# EAGLE design A702X (EAGLE 6.6.0)
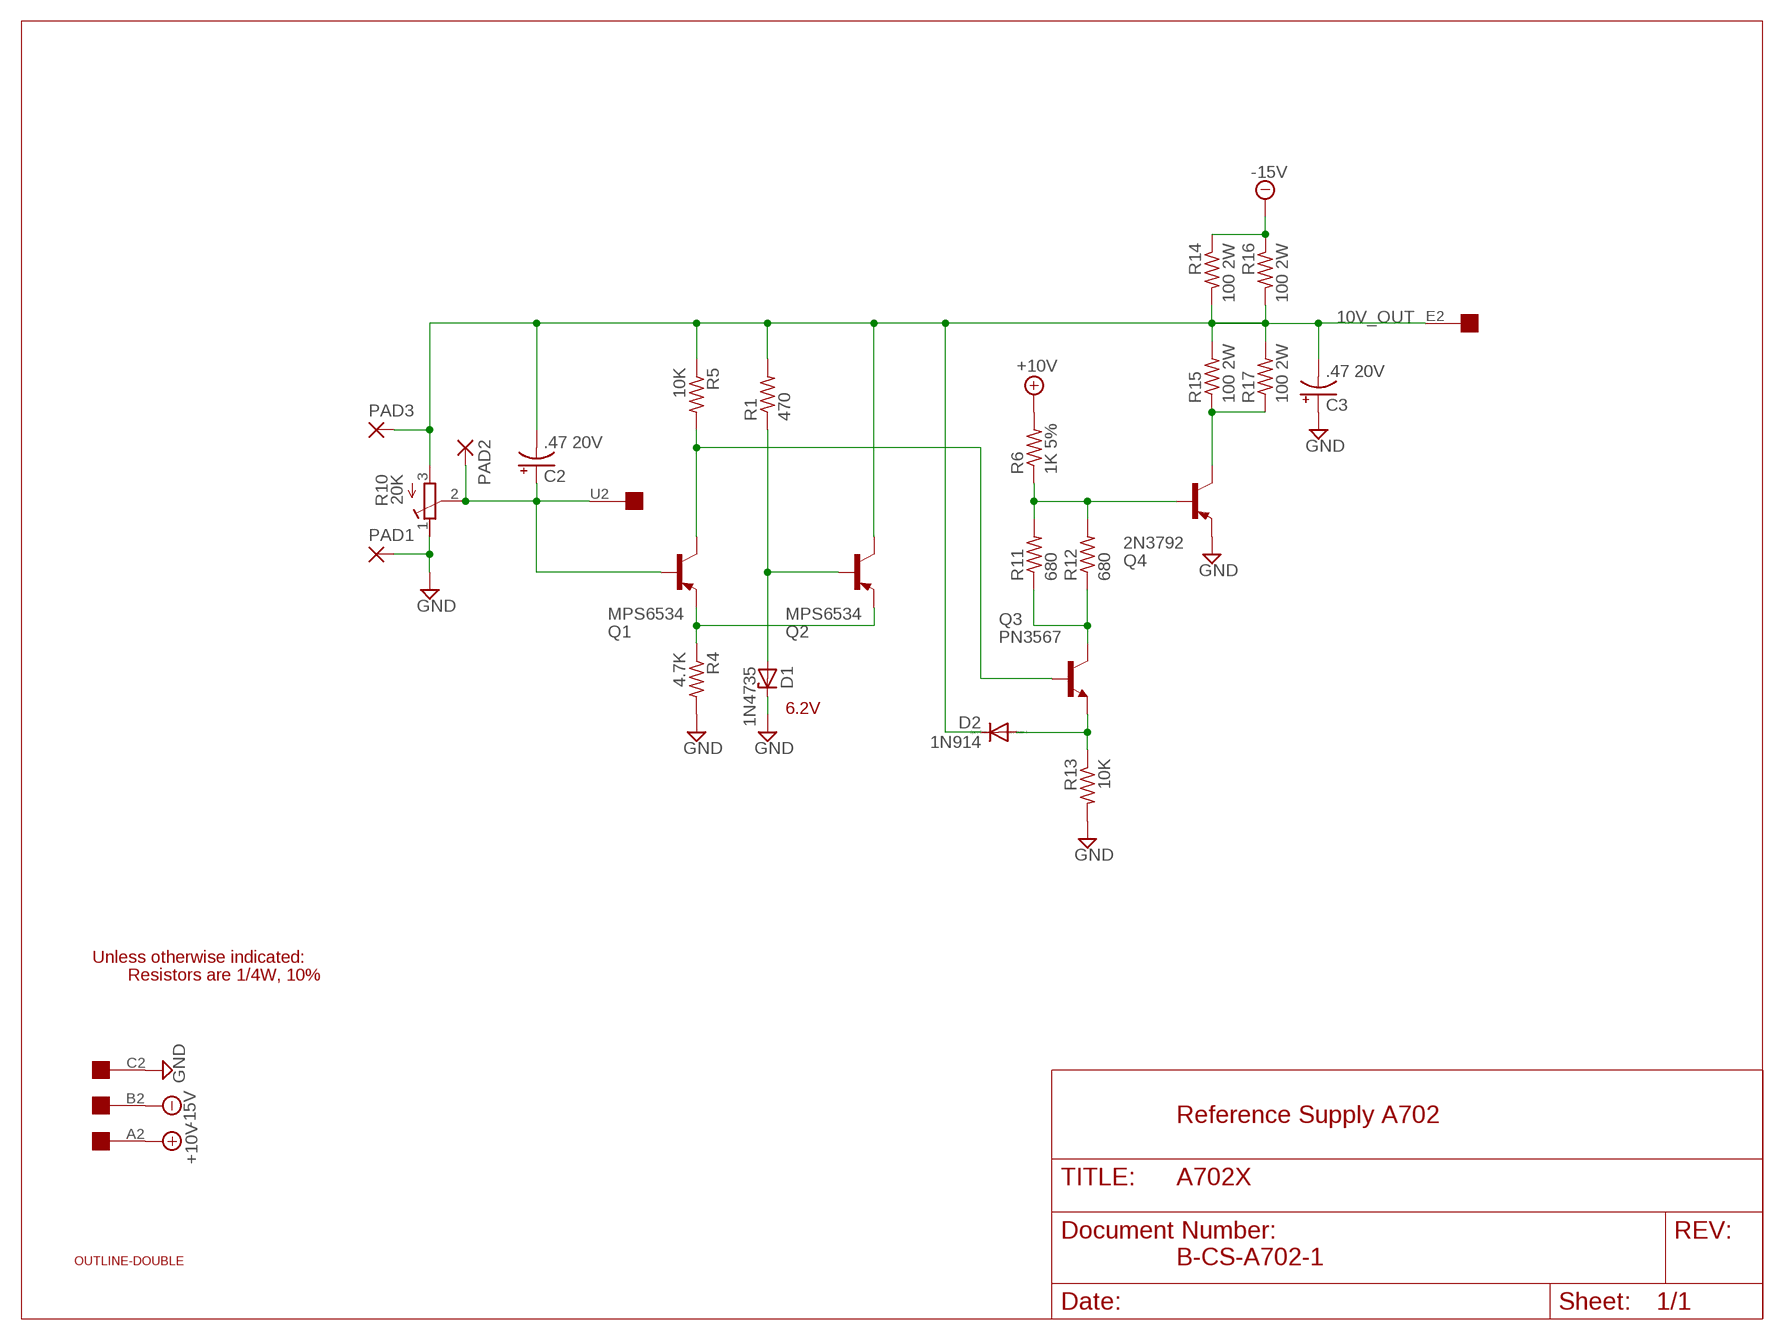
[diagram p0: schematic, sheet 1]

## Parts
C2  .47 20V  CPOL-USE22-6AXIAL  [E22-6]
C3  .47 20V  CPOL-USE22-6AXIAL  [E22-6]
D1  1N4735  1N821  [DO35Z10]
D2  1N914  1N4148DO35-10  [DO35-10]
PAD1  2,54/0,8  [2,54/0,8]
PAD2  2,54/0,8  [2,54/0,8]
PAD3  2,54/0,8  [2,54/0,8]
Q1  MPS6534  2N2904A  [TO39]
Q2  MPS6534  2N2904A  [TO39]
Q3  PN3567  2N2219  [TO5]
Q4  2N3792  -PNP-TO3  [TO3]
R1  470  R-US_0207/10  [0207/10]
R4  4.7K  R-US_0207/10  [0207/10]
R5  10K  R-US_0207/10  [0207/10]
R6  1K 5%  R-US_0207/10  [0207/10]
R10  20K  275P  [3006Y]
R11  680  R-US_0207/10  [0207/10]
R12  680  R-US_0207/10  [0207/10]
R13  10K  R-US_0207/10  [0207/10]
R14  100 2W  R-US_0817/22  [P0817/22]
R15  100 2W  R-US_0817/22  [P0817/22]
R16  100 2W  R-US_0817/22  [P0817/22]
R17  100 2W  R-US_0817/22  [P0817/22]
U$1  OUTLINE-DOUBLE  [DOUBLE]
U$3  EDGE-1  [EDGE-CON1]

## Nets
10V_OUT: C2.- C3.- D2.C PAD3.1(P) Q2.3(C) R1.2 R5.1 R10.3(E) R14.2 R15.2 R16.2 R17.2 U$3.E2
+10V: R6.2 U$3.A2
-15V: R14.1 R16.1 U$3.B2
GND [supply]: C3.+ D1.C PAD1.1(P) Q4.E R4.2 R10.1(A) R13.2 U$3.C2
N$1: Q1.1(E) Q2.1(E) R4.1
N$2: Q3.3(C) R11.1 R12.1
N$3: Q1.3(C) Q3.2(B) R5.2
N$4: Q4.C R15.1 R17.1
N$5: D2.A Q3.1(E) R13.1
N$6: D1.A Q2.2(B) R1.1
N$7: Q4.B R6.1 R11.2 R12.2
U2: C2.+ PAD2.1(P) Q1.2(B) R10.2(S) U$3.U2
Unconnected: U$3.D2 U$3.F2 U$3.H2 U$3.J2 U$3.K2 U$3.L2 U$3.M2 U$3.N2 U$3.P2 U$3.R2 U$3.S2 U$3.T2 U$3.V2

## Notes on the sheet
- 6.2V
- Unless otherwise indicated:
- Resistors are 1/4W, 10%
- Reference Supply A702
- B-CS-A702-1

## Library data of the parts
C2 C3 = rcl:CPOL-US: POLARIZED CAPACITOR, American symbol
D1 = diode:1N821: Reference DIODE temperature compensated, 6,2 V
D2 = diode:1N4148: DIODE high speed (Philips)
PAD1-PAD3 = wirepad:2,54/0,8: THROUGH-HOLE PAD
Q1 Q2 = transistor-pnp:2N2904*: PNP Transistror
Q3 = transistor:2N2219: NPN TRANSISTOR
Q4 = transistor:*-PNP-: PNP Transistror
R1 R4-R6 R11-R17 = rcl:R-US_: RESISTOR, American symbol
R10 = dec-con:275P: Trimpot with 275P (3006Y) footprint.
U$1 = dec-con:OUTLINE-*: Board outlines for DEC boards.
U$3 = dec-con:EDGE-1: Single-Sided DEC Edge Connector -- (side 2)

## Board
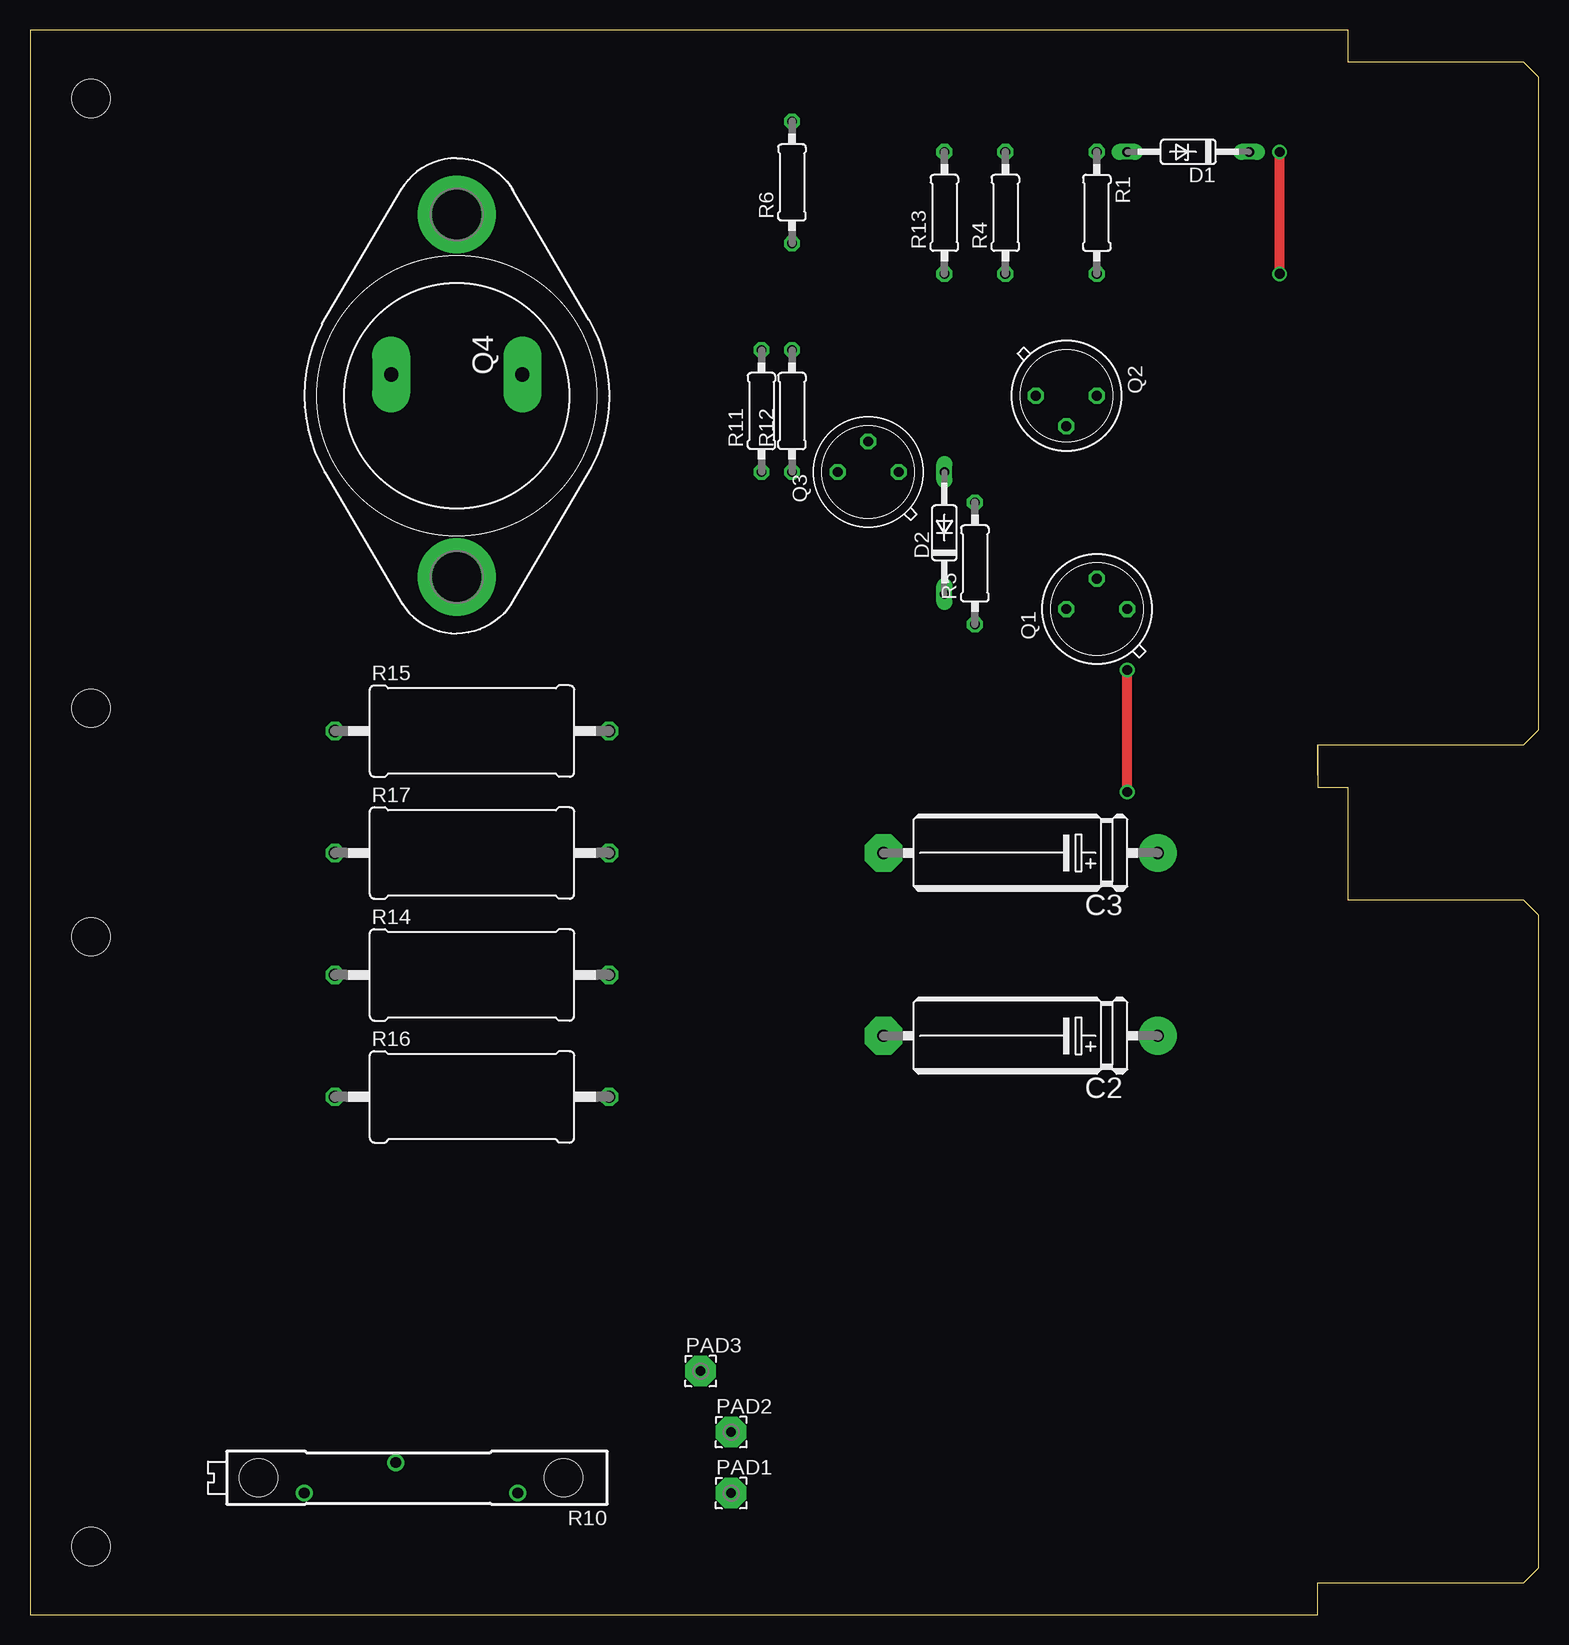
[diagram p1: board, top side]
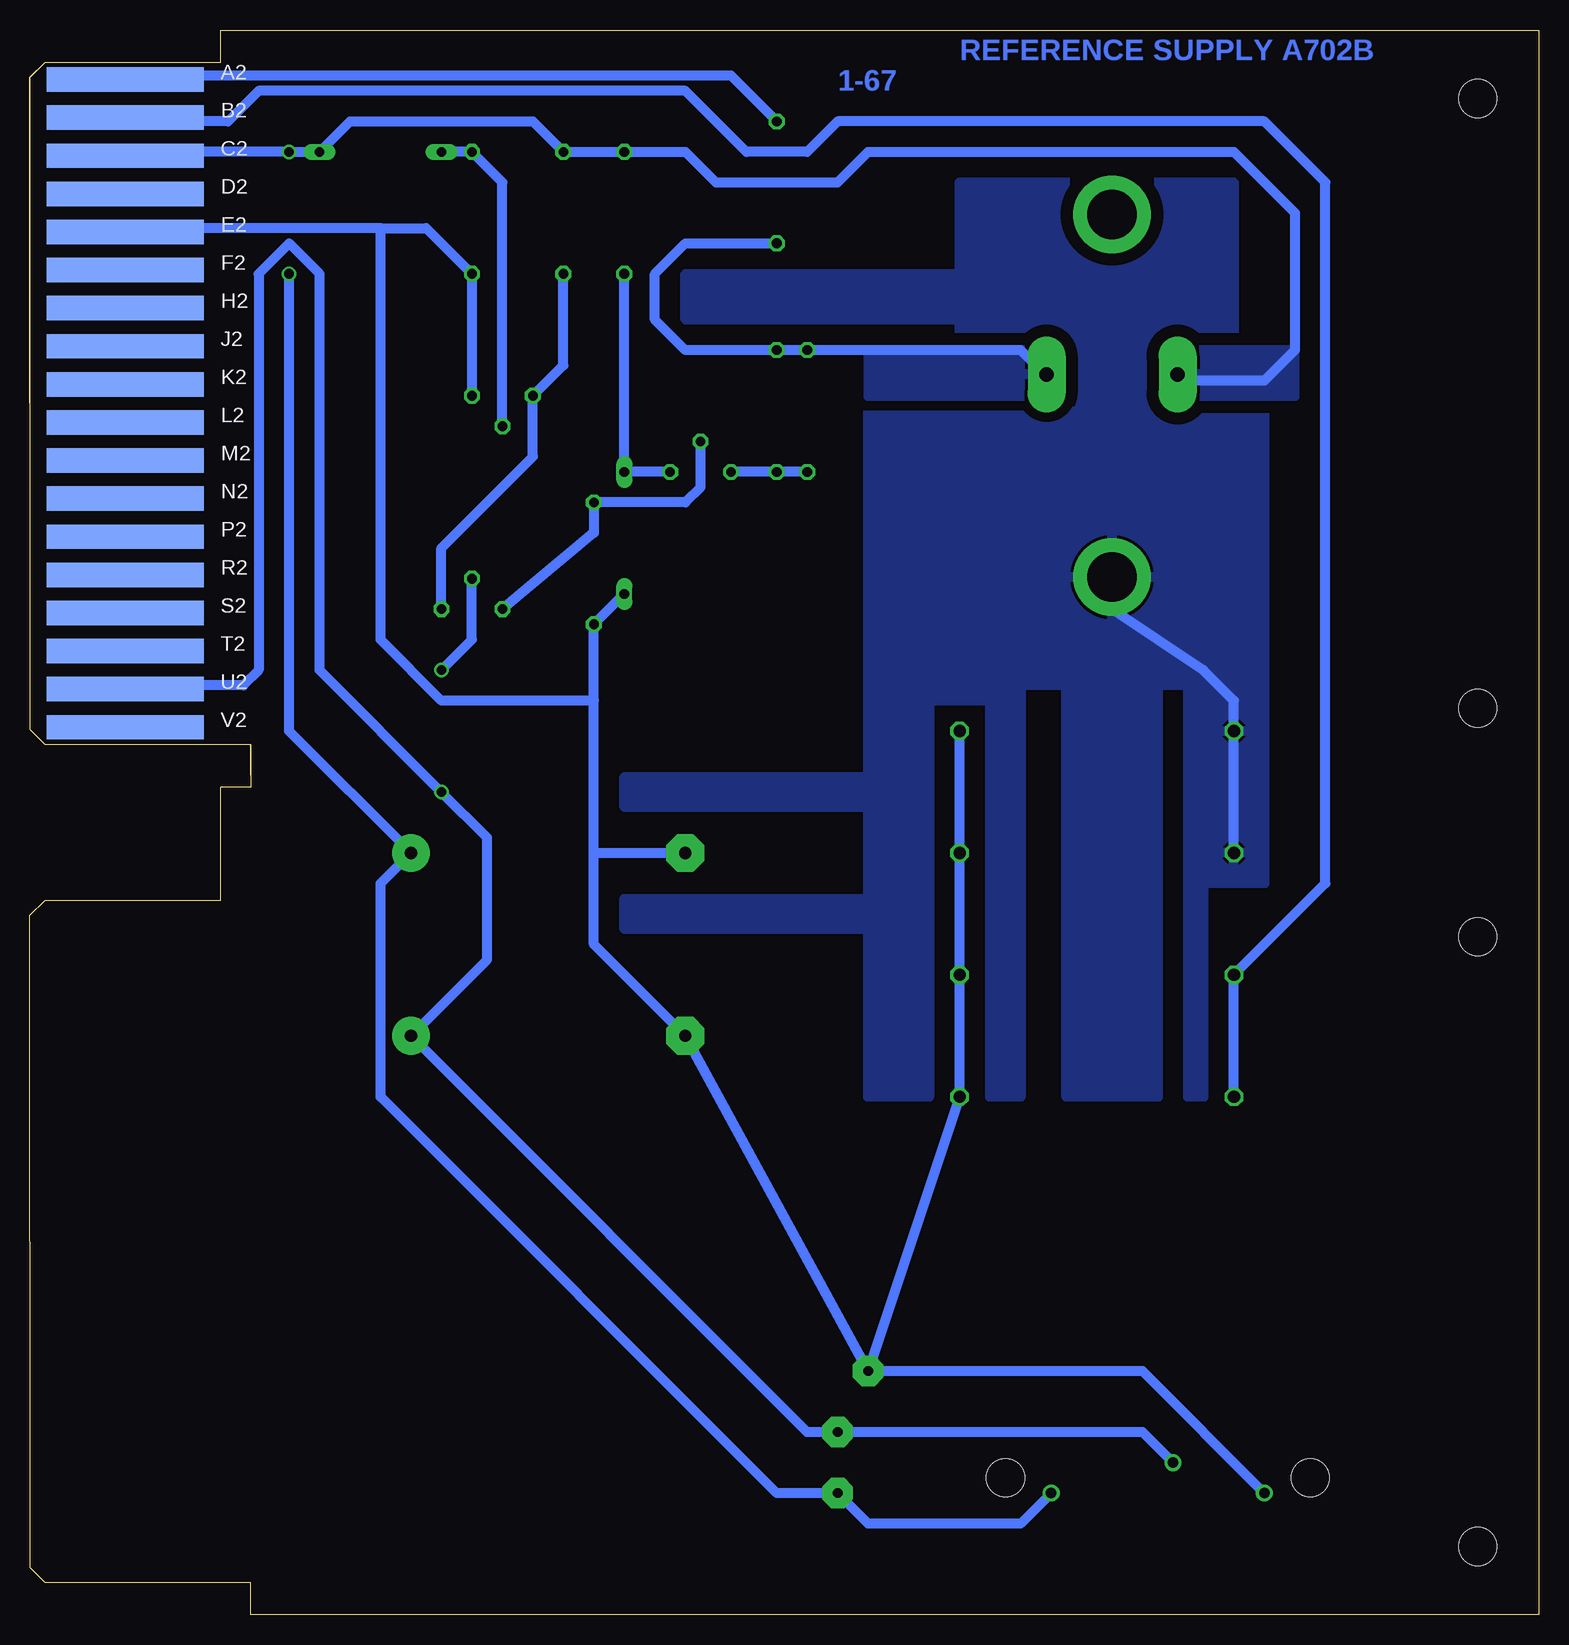
[diagram p2: board, bottom side, seen from below]

Size 125.73 x 132.08 mm. Coordinates in mm from the lower left corner, seen from the top.
Copper layers (1+16): Top 0.035mm / dielectric 1.5mm / Bottom 0.035mm
Design rules "16mils": minimum track width 16mil, minimum drill 32mil, track to track 15mil, track to pad 10mil, pad to pad 10mil, via to via 10mil, smd to smd 10mil, copper to edge 13mil, drill to drill 10mil, minimum pad ring 10mil, minimum via ring 8mil, stop-mask expansion 0mil, vias tented up to drill 0mil, thermal gap 10mil
Holes 3.17 mm at 19.05,11.43 44.45,11.43

### Footprints (pad centres in the part's own frame; a part is rotated, then mirrored left to right if it is on the bottom)
E22-6 = drill 1.016 pad 3.15: + -11.43,0 | drill 1.016 pad 3.15 octagon: - 11.43,0
DO35Z10 = drill 0.813 long: A 5.08,0; C -5.08,0
DO35-10 = drill 0.813 long: A 5.08,0; C -5.08,0
2,54/0,8 = drill 0.813 pad 2.54 octagon: 1 0,0
TO39 = drill 0.813 octagon: 1 0,-2.54; 2 2.54,0; 3 0,2.54
TO5 = drill 0.813 octagon: 1 0,-2.54; 2 2.54,0; 3 0,2.54
TO3 = drill 1.194 pad 3.15 long: B -1.778,5.461; E -1.778,-5.461 | drill 4.115 pad 6.477: C 15.113,0; C/ -15.113,0
0207/10 = drill 0.813 octagon: 1 -5.08,0; 2 5.08,0
3006Y = drill 0.9: 1 -8.89,1.27; 2 1.27,-1.27; 3 8.89,1.27
P0817/22 = drill 1.016 octagon: 1 -11.43,0; 2 11.43,0
DOUBLE = hole 3.175: 120.65,56.515; 120.65,5.715; 120.65,75.565; 120.65,126.365
EDGE-CON1 = smd 13.106 x 2.032 bottom: A2 7.938,4.128; B2 7.938,7.303; C2 7.938,10.477; D2 7.938,13.652; E2 7.938,16.828; F2 7.938,20.003; H2 7.938,23.177; J2 7.938,26.352; K2 7.938,29.527; L2 7.938,32.703; M2 7.938,35.877; N2 7.938,39.053; P2 7.938,42.227; R2 7.938,45.403; S2 7.938,48.578; T2 7.938,51.752; U2 7.938,54.928; V2 7.938,58.102

### Placement (x,y rotation side)
C2  82.55,48.26 180 top
C3  82.55,63.5 180 top
D1  96.52,121.92 180 top
D2  76.2,90.17 90 top
PAD1  58.42,10.16 0 top
PAD2  58.42,15.24 0 top
PAD3  55.88,20.32 0 top
Q1  88.9,83.82 90 top
Q2  86.36,101.6 270 top
Q3  69.85,95.25 90 top
Q4  35.56,101.6 270 top
R1  88.9,116.84 270 top
R4  81.28,116.84 90 top
R5  78.74,87.63 90 top
R6  63.5,119.38 90 top
R10  31.75,11.43 180 top
R11  60.96,100.33 90 top
R12  63.5,100.33 90 top
R13  76.2,116.84 90 top
R14  36.83,53.34 0 top
R15  36.83,73.66 0 top
R16  36.83,43.18 0 top
R17  36.83,63.5 0 top
U$1  125.73,132.08 180 top
U$3  125.73,132.08 180 top

### Tracks (layer width: path | path; a pad name or v marks a point on that pad's centre or on a via)
10V_OUT
  Bottom 0.813: U$3.E2 117.17,115.24 116.84,115.57 96.52,115.57 | 96.52,115.57 92.71,115.57 R1.2 Q2.3 | D2.C R5.1 78.74,76.2 | 78.74,63.5 C3.- | 78.74,63.5 78.74,76.2 | 78.74,63.5 78.74,55.88 C2.- PAD3.1 | R15.2 R17.2 R14.2 R16.2 PAD3.1 | R10.3 33.02,20.32 PAD3.1 | 78.74,76.2 91.44,76.2 96.52,81.28 96.52,115.57
+10V
  Bottom 0.813: U$3.A2 116.84,127.89 116.84,128.27 67.31,128.27 R6.2
-15V
  Bottom 0.813: U$3.B2 117.13,124.75 116.84,124.46 109.22,124.46 106.68,127 71.12,127 66.04,121.92 60.96,121.92 58.42,124.46 22.86,124.46 17.78,119.38 17.78,60.96 R14.1 R16.1
GND  (via drill 0.81)
  Top 0.813: v104.14,111.76 v104.14,121.92
  Bottom 0.813: U$3.C2 117.17,121.59 116.84,121.92 v104.14,121.92 D1.C 99.06,124.46 83.82,124.46 R4.2 R13.2 71.12,121.92 68.58,119.38 58.42,119.38 55.88,121.92 25.4,121.92 20.32,116.84 20.32,105.41 22.86,102.87 29.21,102.87 Q4.E | R10.1 43.18,7.62 55.88,7.62 PAD1.1 63.5,10.16 96.52,43.18 96.52,60.96 C3.+ 104.14,73.66 v104.14,111.76
  pour Bottom (isolate 1.016): 30.48,101.6 20.32,101.6 20.32,105.41 30.48,105.41
N$1
  Bottom 0.813: R4.1 81.28,104.14 Q2.1 83.82,96.52 91.44,88.9 Q1.1
N$2
  Bottom 0.813: R11.1 R12.1 Q3.3
N$3
  Bottom 0.813: Q3.2 69.85,93.98 71.12,92.71 R5.2 78.74,90.17 Q1.3
N$4
  Bottom 0.813: R17.1 R15.1 25.4,76.2 27.94,78.74 35.56,83.82 Q4.C
  pour Bottom (isolate 0.813, rank 2): 31.75,93.98 31.75,43.18 39.37,43.18 39.37,93.98
  pour Bottom (isolate 1.016, rank 2): 22.86,60.96 27.94,60.96 27.94,43.18 29.21,43.18 29.21,77.47 48.26,77.47 48.26,107.95 71.12,107.95 71.12,111.76 48.26,111.76 48.26,119.38 25.4,119.38 25.4,100.33 22.86,100.33
  pour Bottom (isolate 0.813, rank 2): 43.18,43.18 45.72,43.18 45.72,76.2 50.8,76.2 50.8,43.18 55.88,43.18 55.88,57.15 76.2,57.15 76.2,59.69 55.88,59.69 55.88,67.31 76.2,67.31 76.2,69.85 55.88,69.85 55.88,100.33 38.1,100.33 38.1,78.74 43.18,78.74
N$5
  Bottom 0.813: R13.1 D2.A Q3.1
N$6
  Bottom 0.813: D1.A R1.1 86.36,119.38 Q2.2
N$7
  Bottom 0.813: Q4.B 41.15,103.38 43.18,105.41 R11.2 R12.2 71.12,105.41 73.66,107.95 73.66,111.76 71.12,114.3 R6.1
  pour Bottom: 40.64,105.41 55.88,105.41 55.88,101.6 40.64,101.6
U2  (via drill 0.81)
  Top 0.813: v91.44,68.58 v91.44,78.74
  Bottom 0.813: U$3.U2 117.2,77.11 116.84,77.47 107.95,77.47 106.68,78.74 106.68,111.76 104.14,114.3 101.6,111.76 101.6,78.74 v91.44,68.58 87.63,64.77 87.63,54.61 C2.+ 60.96,15.24 PAD2.1 33.02,15.24 R10.2 | Q1.2 88.9,81.28 v91.44,78.74

### Text on the board
Bottom: REFERENCE SUPPLY A702B | 1-67